# Altium project MPPT.PrjPcb
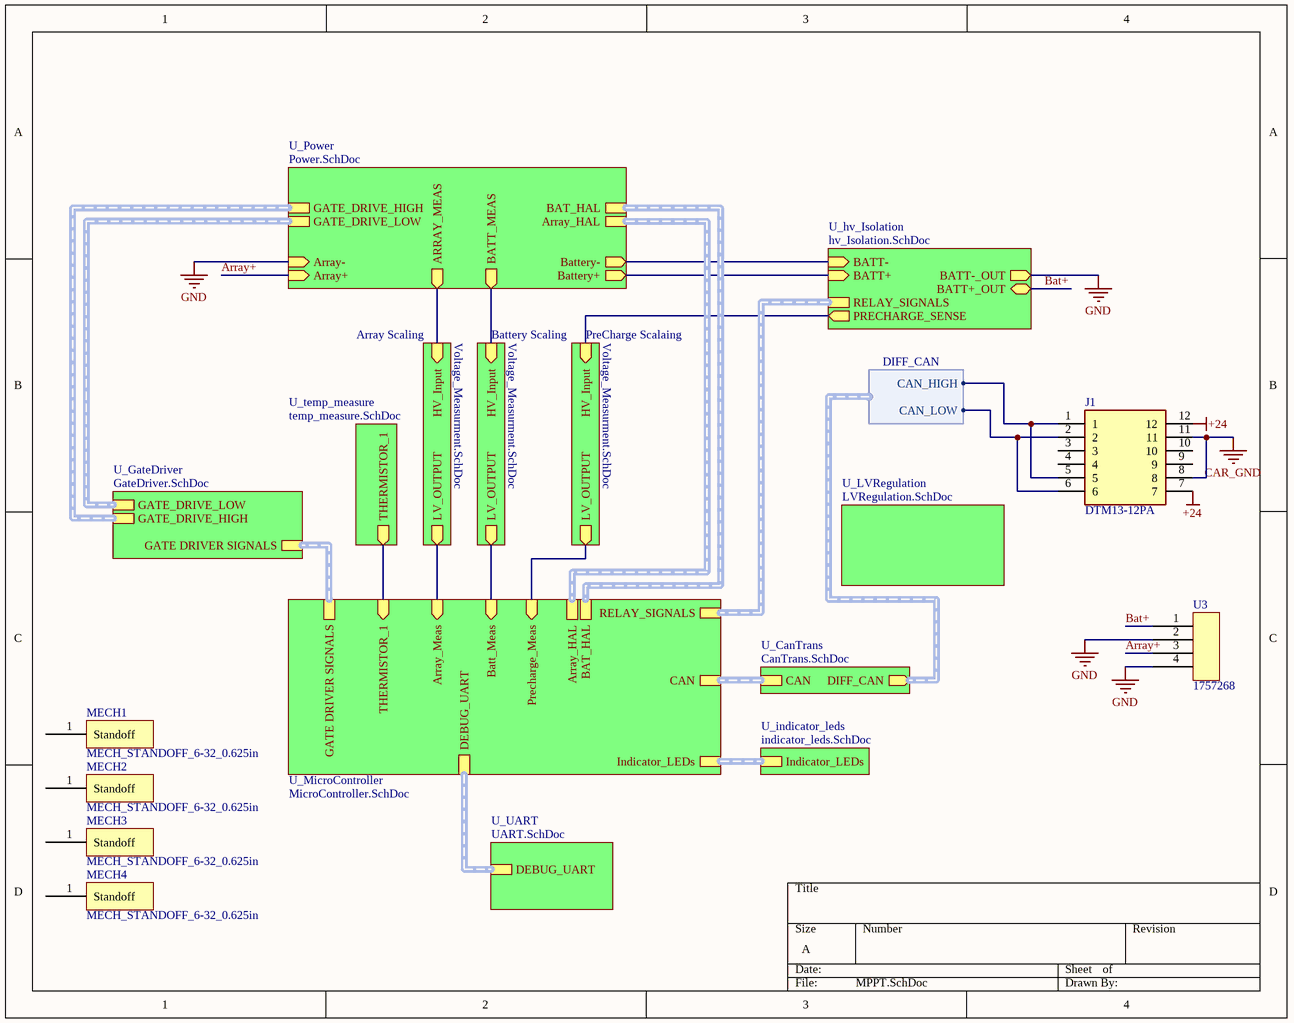
[diagram p0: MPPT.SchDoc]
12 sheets, 127 parts. Net scope: hierarchical (ports join the sheet entries above them; power ports are global).
Board file: MPPT.PcbDoc
Sheets:
  MPPT.SchDoc
    U_GateDriver = GateDriver.SchDoc
    U_Power = Power.SchDoc
    U_MicroController = MicroController.SchDoc
      U_JTAG = JTAG.SchDoc
    U_CanTrans = CanTrans.SchDoc
    Array Scaling = Voltage_Measurment.SchDoc
    Battery Scaling = Voltage_Measurment.SchDoc
    U_LVRegulation = LVRegulation.SchDoc
    U_hv_Isolation = hv_Isolation.SchDoc
    U_indicator_leds = indicator_leds.SchDoc
    U_temp_measure = temp_measure.SchDoc
    PreCharge Scalaing = Voltage_Measurment.SchDoc
    U_UART = UART.SchDoc

## Sheet MPPT.SchDoc
size A; SheetNumber: 1; SheetTotal: 12

### Parts
J1  DTM13-12PA  [TE_DTM13-12PA]
MECH1  MECH_STANDOFF_6-32_0.625in  [STANDOFF_6-32_0.625in]
MECH2  MECH_STANDOFF_6-32_0.625in  [STANDOFF_6-32_0.625in]
MECH3  MECH_STANDOFF_6-32_0.625in  [STANDOFF_6-32_0.625in]
MECH4  MECH_STANDOFF_6-32_0.625in  [STANDOFF_6-32_0.625in]
U3  1757268  [1757268-Footprint-1]

### Sub-sheets
Array Scaling = Voltage_Measurment.SchDoc: LV_OUTPUT (out), HV_Input (in)
Battery Scaling = Voltage_Measurment.SchDoc: LV_OUTPUT (out), HV_Input (in)
PreCharge Scalaing = Voltage_Measurment.SchDoc: LV_OUTPUT (out), HV_Input (in)
U_CanTrans = CanTrans.SchDoc: CAN (harness CAN), DIFF_CAN (out, harness DIFF_CAN)
U_GateDriver = GateDriver.SchDoc: GATE DRIVER SIGNALS (harness Gate Driver), GATE_DRIVE_HIGH (harness GATE_DRIVE), GATE_DRIVE_LOW (harness GATE_DRIVE)
U_hv_Isolation = hv_Isolation.SchDoc: BATT+_OUT (bidir), BATT-_OUT (out), BATT+ (in), BATT- (in), RELAY_SIGNALS, PRECHARGE_SENSE (out)
U_indicator_leds = indicator_leds.SchDoc: Indicator_LEDs (harness Indicator LEDs)
U_LVRegulation = LVRegulation.SchDoc: no entries
U_MicroController = MicroController.SchDoc: CAN (harness CAN), Batt_Meas (in), Array_Meas (in), GATE DRIVER SIGNALS (harness Gate Driver), RELAY_SIGNALS (harness RELAY SIGNALS), Indicator_LEDs, THERMISTOR_1 (in), BAT_HAL, Array_HAL, Precharge_Meas (in), DEBUG_UART (harness DEBUG_UART)
U_Power = Power.SchDoc: Array- (in), Array+ (in), Battery+ (out), Battery- (out), GATE_DRIVE_HIGH, GATE_DRIVE_LOW, BATT_MEAS (out), ARRAY_MEAS (out), BAT_HAL (harness HAL_OUTPUT), Array_HAL (harness HAL_OUTPUT)
U_temp_measure = temp_measure.SchDoc: THERMISTOR_1 (out)
U_UART = UART.SchDoc: DEBUG_UART

### Harnesses
DIFF_CAN: CAN_HIGH, CAN_LOW

### Nets
+24: J1.7 J1.12
CAR_GND: J1.8 J1.11
GND: U3.2 U3.4 ; sheet U_Power/Array-, sheet U_Power/Battery-, sheet U_hv_Isolation/BATT-_OUT, sheet U_hv_Isolation/BATT-
Array+: U3.3 ; sheet U_Power/Array+
Array_Measure: sheet U_Power/ARRAY_MEAS, sheet Array Scaling/HV_Input
Bat+: U3.1 ; sheet U_hv_Isolation/BATT+_OUT
boost_output: sheet U_Power/BATT_MEAS, sheet Battery Scaling/HV_Input
CAN_N: J1.2 J1.6 ; sheet U_CanTrans/DIFF_CAN.CAN_LOW
CAN_P: J1.1 J1.5 ; sheet U_CanTrans/DIFF_CAN.CAN_HIGH
NetC27A_2: sheet U_MicroController/Array_Meas, sheet Array Scaling/LV_OUTPUT
NetC27B_2: sheet U_MicroController/Batt_Meas, sheet Battery Scaling/LV_OUTPUT
NetC27C_2: sheet U_MicroController/Precharge_Meas, sheet PreCharge Scalaing/LV_OUTPUT
NetF1_2: sheet U_Power/Battery+, sheet U_hv_Isolation/BATT+
NetJ3_2: sheet U_MicroController/THERMISTOR_1, sheet U_temp_measure/THERMISTOR_1
NetK1_4: sheet U_hv_Isolation/PRECHARGE_SENSE, sheet PreCharge Scalaing/HV_Input

Not connected (* = marked no-connect by the designer): J1 3 4 9 10; MECH1 1(Standoff); MECH2 1(Standoff); MECH3 1(Standoff); MECH4 1(Standoff)

### Buses and harness runs
harness sheet U_CanTrans/CAN = sheet U_MicroController/CAN
harness sheet U_GateDriver/GATE DRIVER SIGNALS = sheet U_MicroController/GATE DRIVER SIGNALS
harness sheet U_GateDriver/GATE_DRIVE_HIGH = sheet U_Power/GATE_DRIVE_HIGH
harness sheet U_GateDriver/GATE_DRIVE_LOW = sheet U_Power/GATE_DRIVE_LOW
harness sheet U_hv_Isolation/RELAY_SIGNALS = sheet U_MicroController/RELAY_SIGNALS
harness sheet U_indicator_leds/Indicator_LEDs = sheet U_MicroController/Indicator_LEDs
harness sheet U_MicroController/Array_HAL = sheet U_Power/Array_HAL
harness sheet U_MicroController/BAT_HAL = sheet U_Power/BAT_HAL
harness sheet U_MicroController/DEBUG_UART = sheet U_UART/DEBUG_UART

### Library data of the parts
J1 = CMP-183-000000-3: 12 way DTM13 A key Receptacle with PCB mount and 90 degree molded pins. Sealable, with centerline pitch .165 inch/4 millimeters. Gray.; Gender: Male; Voltage Rating: 250V; Connector Type: COMBINATION LINE CONNECTOR; Max Current Rating: 11A; Mounting Technology: TH; Case/Package: 12-DIP; Pins: 12; RoHS Compliant: Yes
MECH1-MECH4 = CMP-044-000005-2: Hex Standoff Threaded #6-32 Aluminum 0.625" (15.88mm) 5/8"; Design Item ID: MECH_STANDOFF_6-32_0.625in; Source: mech.SchLib
U3 = CMP-002-00132-2: Strip Terminal Block, 12A, 1 Row(s), 1 Deck(s); Plug: 1110583; Gender: Male; Connector Type: Header; Voltage Rating: 250V; Max Current Rating: 12A; Mounting Technology: TH; Case/Package: SIP-4; Pins: 4; RoHS Compliant: Yes

## Sheet GateDriver.SchDoc
size A; SheetNumber: 2; SheetTotal: 12
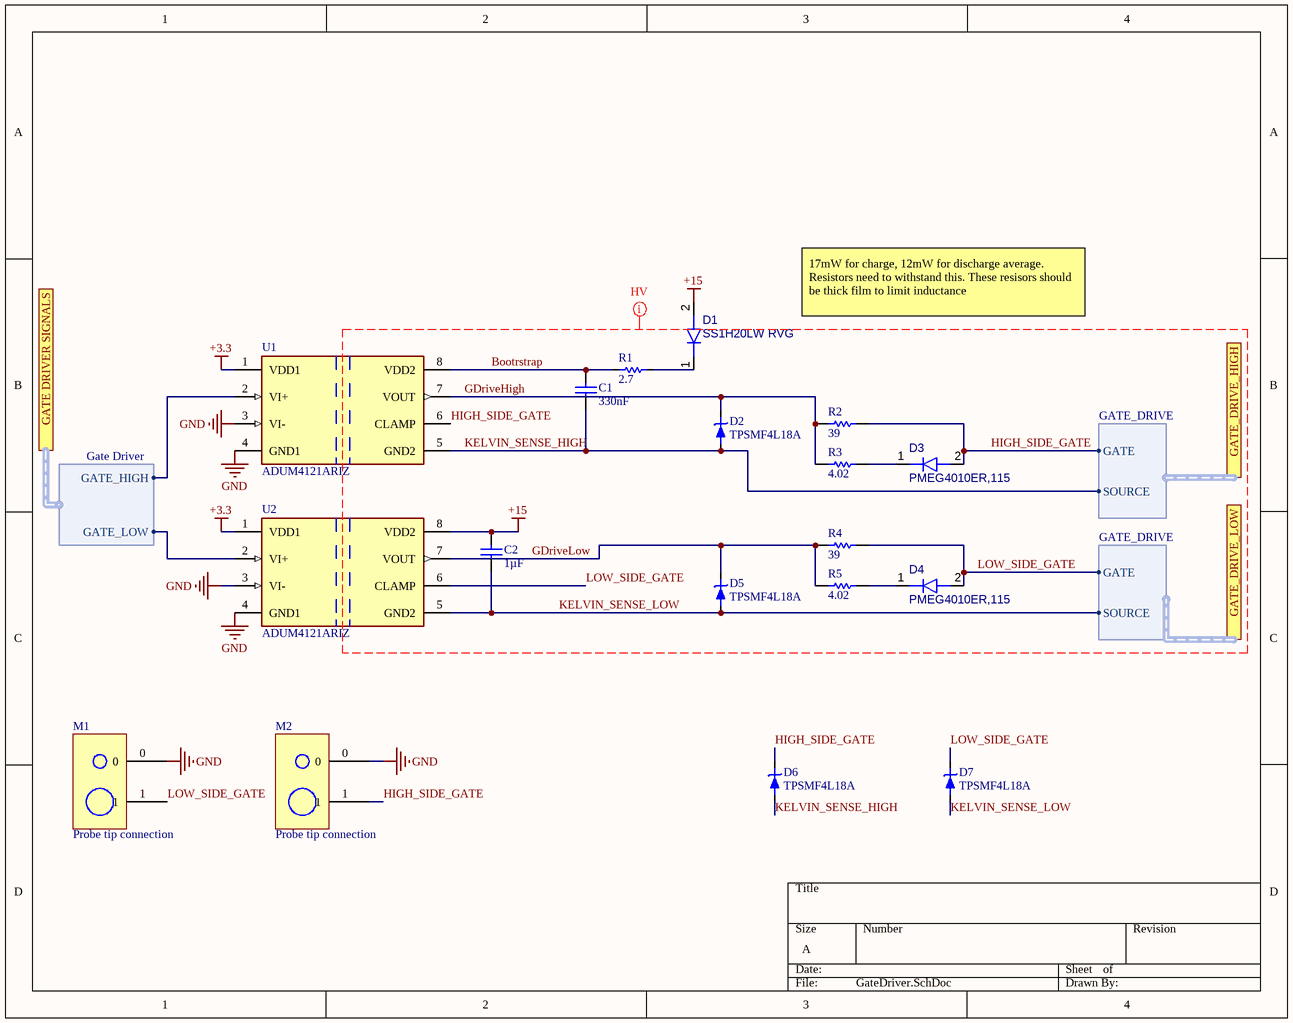
[diagram p1: GateDriver.SchDoc]

### Parts
C1  value 330nF  [1206_CAPACITOR]  (hidden comment: C1206X334K5RACAUTO)
C2  value 1µF  [0805_Capacitor]  (hidden comment: CAP 0805 1uF 50V)
D1  SS1H20LW RVG  [PMEG4010ER,115-Footprint-1]
D2  TPSMF4L18A  [TPSMF4L18A-Footprint-1]
D3  PMEG4010ER,115  [PMEG4010ER,115-Footprint-1]
D4  PMEG4010ER,115  [PMEG4010ER,115-Footprint-1]
D5  TPSMF4L18A  [TPSMF4L18A-Footprint-1]
D6  TPSMF4L18A  [TPSMF4L18A-Footprint-1]
D7  TPSMF4L18A  [TPSMF4L18A-Footprint-1]
M1  Probe tip connection  [Probe tip connection-Footprint-1]
M2  Probe tip connection  [Probe tip connection-Footprint-1]
R1  value 2.7  [1210_Resistor]  (hidden comment: R_CRCW12102R70JNEA)
R2  value 39  [0805_Resistor]  (hidden comment: RMCF0805JT39R0)
R3  value 4.02  [0805_Resistor]  (hidden comment: CRCW08054R02FKEA)
R4  value 39  [0805_Resistor]  (hidden comment: RMCF0805JT39R0)
R5  value 4.02  [0805_Resistor]  (hidden comment: CRCW08054R02FKEA)
U1  ADUM4121ARIZ  [FP-RI-8-1-IPC_B]
U2  ADUM4121ARIZ  [FP-RI-8-1-IPC_B]

### Ports
GATE DRIVER SIGNALS (harness Gate Driver, see MPPT[1C], MicroController[3A]), GATE_DRIVE_HIGH (harness GATE_DRIVE, see MPPT[1C], Power[3C]), GATE_DRIVE_LOW (harness GATE_DRIVE, see MPPT[1B], Power[3C])

### Harnesses
Gate Driver: GATE_HIGH, GATE_LOW
GATE_DRIVE: SOURCE, GATE

### Nets
+3.3: U1.1(VDD1) U2.1(VDD1)
+15: C2.2 D1.2(A) U2.8(VDD2)
GND: M1.0 M2.0 U1.3(VI-) U1.4(GND1) U2.3(VI-) U2.4(GND1)
Bootrstrap: C1.2 R1.1 U1.8(VDD2)
GATE_HIGH: U1.2(VI+) ; port GATE DRIVER SIGNALS.GATE_HIGH
GATE_LOW: U2.2(VI+) ; port GATE DRIVER SIGNALS.GATE_LOW
GDriveHigh: D2.2(Cathode) R2.1 R3.1 U1.7(VOUT)
GDriveLow: D5.2(Cathode) R4.1 R5.1 U2.7(VOUT)
HIGH_SIDE_GATE: D3.2(A) D6.2(Cathode) M2.1 R2.2 U1.6(CLAMP) ; port GATE_DRIVE_HIGH.GATE
KELVIN_SENSE_HIGH: C1.1 D2.1(Anode) D6.1(Anode) U1.5(GND2) ; port GATE_DRIVE_HIGH.SOURCE
KELVIN_SENSE_LOW: C2.1 D5.1(Anode) D7.1(Anode) U2.5(GND2) ; port GATE_DRIVE_LOW.SOURCE
LOW_SIDE_GATE: D4.2(A) D7.2(Cathode) M1.1 R4.2 U2.6(CLAMP) ; port GATE_DRIVE_LOW.GATE
NetD1_1: D1.1(K) R1.2
NetD3_1: D3.1(K) R3.2
NetD4_1: D4.1(K) R5.2

### Layout directives
net class HV: +15, Bootrstrap, GDriveHigh, GDriveLow, HIGH_SIDE_GATE, KELVIN_SENSE_HIGH, KELVIN_SENSE_LOW, LOW_SIDE_GATE

### Notes on the sheet
- 17mW for charge, 12mW for discharge average. Resistors need to withstand this. These resisors should be thick film to limit inductance

### Library data of the parts
C1 = CMP-001-00124-1: Ceramic Capacitor, Multilayer, Ceramic, 50V, 10% +Tol, 10% -Tol, X7R, 15% TC, 0.33uF, Surface Mount, 1206; Pins: 2; Case/Package: 1206; Tolerance: 10%; Max Operating Temperature: 125°C; Capacitor Type: Ceramic; Mounting Technology: SMD; Voltage Rating: 50V; Min Operating Temperature: -55°C
C2 = CMP-001-00098-1: Tolerance: 10%; Capacitor Type: Ceramic; Voltage Rating: 50V; Case/Package: 0805; Mounting Technology: SMT
D1 = CMP-004-00055-1: Rectifier Diode Schottky 200V 1A 2-Pin SOD-123W T/R; Max Surge Current: 40A; Forward Voltage: 490mV; Forward Current: 1A; Max Operating Temperature: 150°C; Average Rectified Current: 1A; Packaging: Tape and Reel; RoHS Compliant: Yes; Pins: 2; Mounting Technology: Surface Mount; Max Reverse Voltage (DC): 200V
D2 D5-D7 = CMP-004-00053-2: TVS DIODE 18V 29.2V SOD123FL; Min Breakdown Voltage: 20V; Peak Pulse Power: 400W; Number of Unidirectional Channels: 1; Peak Pulse Current: 13.7A; Power Line Protection: No; Max Operating Temperature: 150°C; Packaging: Cut Tape; Min Operating Temperature: -55°C; RoHS Compliant: Yes; Reverse Standoff Voltage: 18V; Resistor Type: Zener; Mounting Technology: Surface Mount; Clamping Voltage: 29.2V
D3 D4 = CMP-004-00045-1: Rectifier Diode, Schottky, 1 Phase, 1 Element, 1A, 40V V(RRM), Silicon; Max Surge Current: 40A; Forward Voltage: 490mV; Forward Current: 1A; Peak Inverse Voltage: 40V; Max Operating Temperature: 150°C; Case/Package: SOD-123W; RoHS Compliant: Yes; Pins: 2; Mounting Technology: SMD
M1 M2 = CMP-00028-00009-3: Connection for oscilscope ground tip
R1 = CMP-058-000074-3: RES SMD 2.7 OHM 5% 1/2W 1210; Power: 500mW; Voltage Rating: 200V; Min Operating Temperature: -55°C; Case/Package: 1210; Pins: 2; Max Operating Temperature: 155°C; Tolerance: 5%; Mounting Technology: SMD
R2 R4 = Resistor     0012-1: Fixed Resistor, Metal Glaze/thick Film, 0.125W, 39ohm, 150V, 5% +/-Tol, 200ppm/Cel, Surface Mount, 0805; Power: 125mW; Mounting Technology: SMD; Min Operating Temperature: -55°C; RoHS Compliant: Yes; Tolerance: 5%; Max Operating Temperature: 155°C; Case/Package: 0805
R3 R5 = Resistor     0013-1: Fixed Resistor, Metal Glaze/thick Film, 0.125W, 4.02ohm, 150V, 1% +/-Tol, 100ppm/Cel, Surface Mount, 0805; Power: 125mW; Tolerance: 1%; Mounting Technology: SMD; Min Operating Temperature: -55°C; Case/Package: 0805; RoHS Compliant: Yes; Max Operating Temperature: 155°C
U1 U2 = CMP-00024-00007-1: 2A gat driver; Pins: 8; RoHS Compliant: Yes; Max Operating Temperature: 125°C; Min Operating Temperature: -40°C

## Sheet Power.SchDoc
size B; SheetNumber: 3; SheetTotal: 12
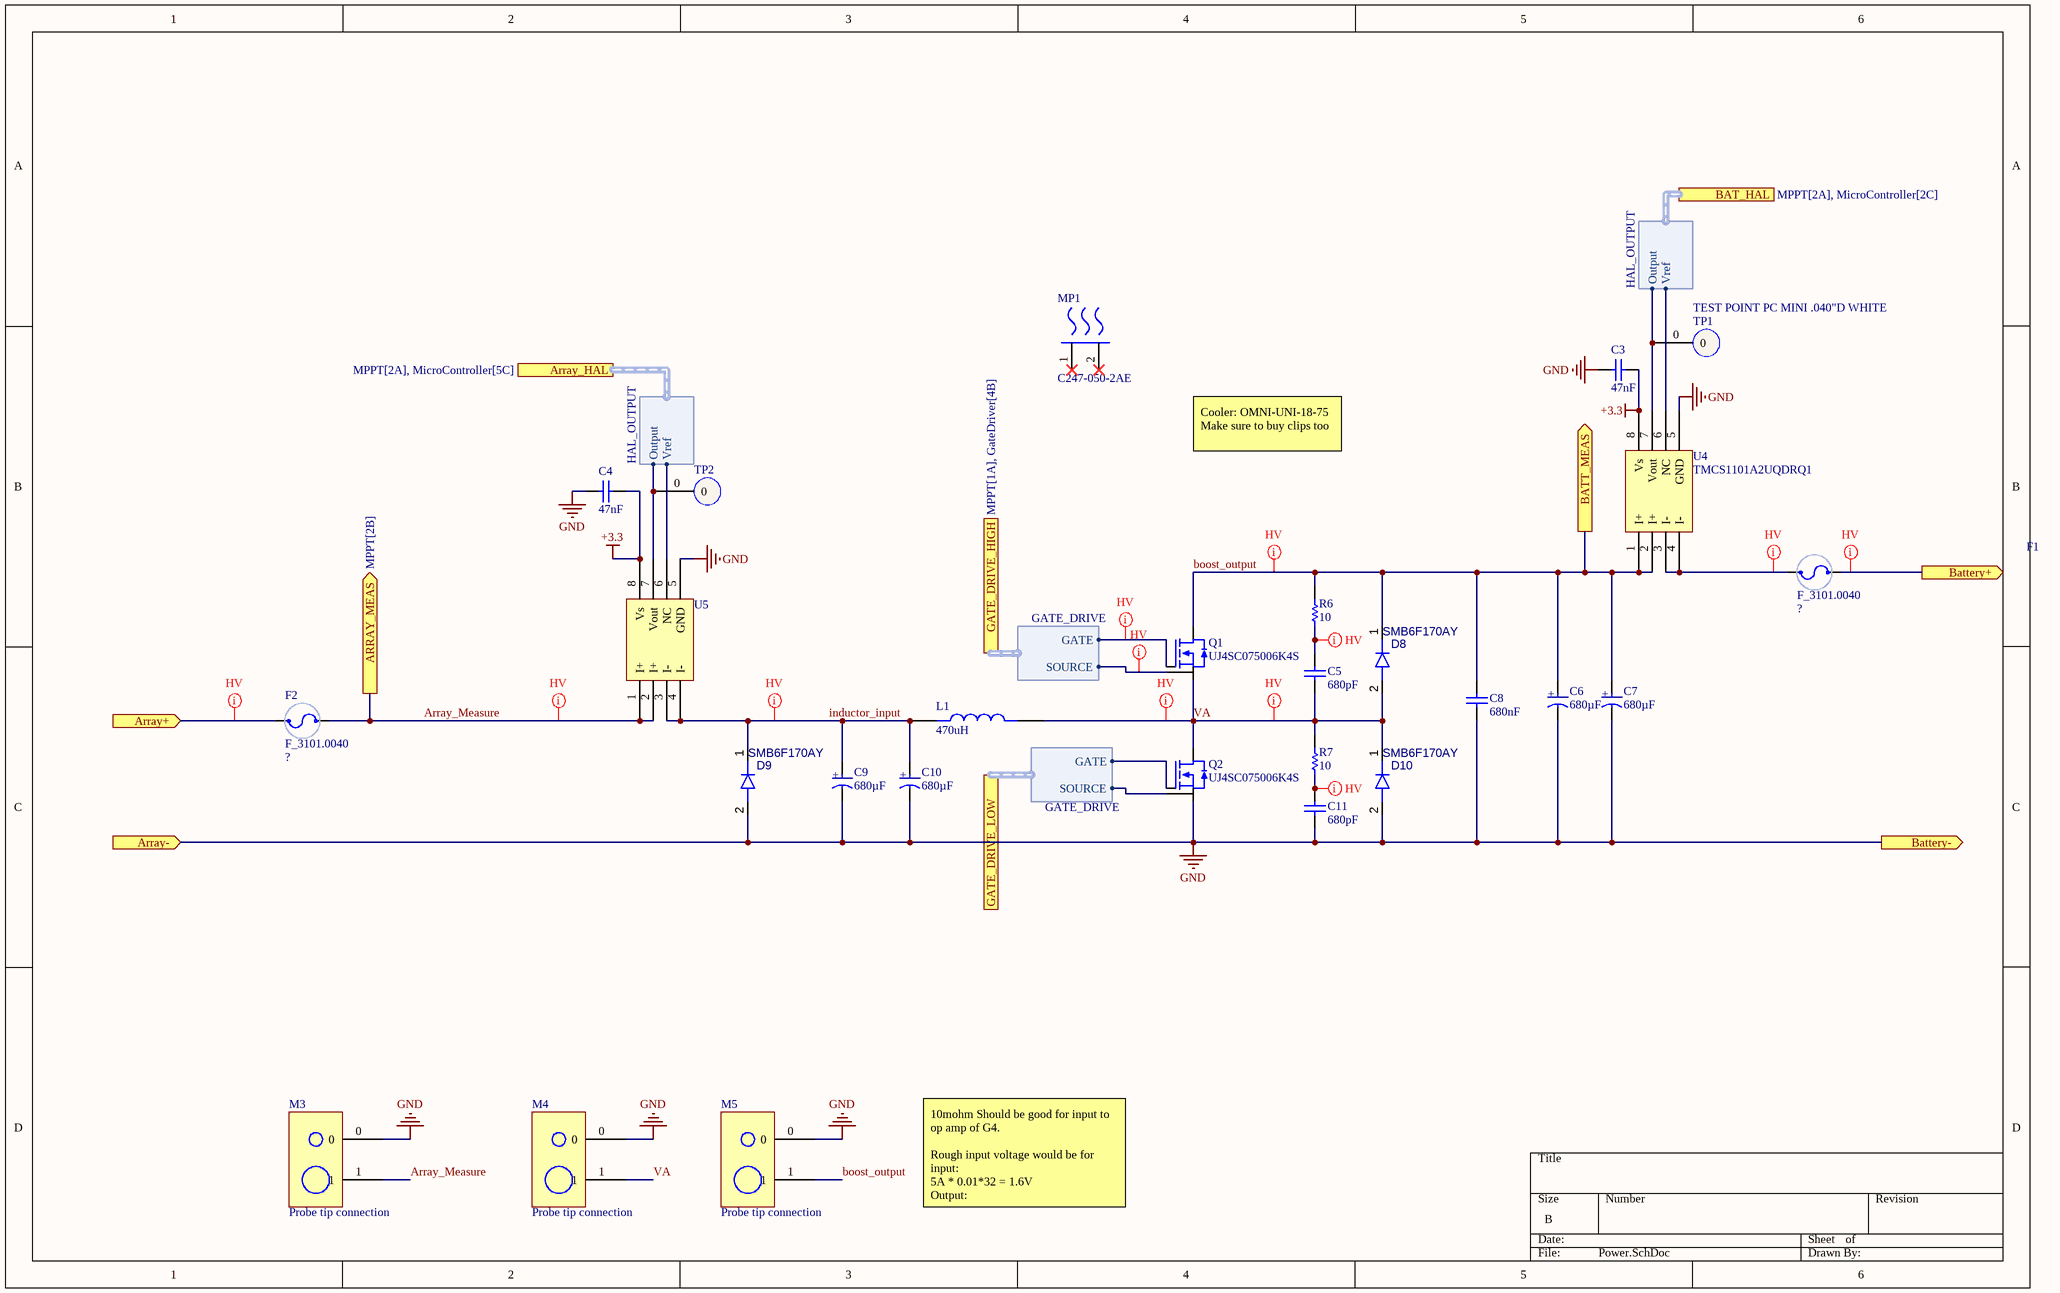
[diagram p2: Power.SchDoc]

### Parts
C3  value 47nF  [0603_CAPACITOR]  (hidden comment: C0603C473K4RECAUTO)
C4  value 47nF  [0603_CAPACITOR]  (hidden comment: C0603C473K4RECAUTO)
C5  value 680pF  [0805_Capacitor]  (hidden comment: C0805C681K2RAC7800)
C6  value 680µF  [381LR681M200J032-Footprint-1]  (hidden comment: 381LR681M200K022)
C7  value 680µF  [381LR681M200J032-Footprint-1]  (hidden comment: 381LR681M200K022)
C8  value 680nF  [684MMR400K-Footprint-1]  (hidden comment: 684MMR400K)
C9  value 680µF  [381LR681M200J032-Footprint-1]  (hidden comment: 381LR681M200K022)
C10  value 680µF  [381LR681M200J032-Footprint-1]  (hidden comment: 381LR681M200K022)
C11  value 680pF  [0805_Capacitor]  (hidden comment: C0805C681K2RAC7800)
D8  SMB6F170AY  [SMB6F170AY-Footprint-1]
D9  SMB6F170AY  [SMB6F170AY-Footprint-1]
D10  SMB6F170AY  [SMB6F170AY-Footprint-1]
F1  F_3101.0040  [F_FPG4]
F2  F_3101.0040  [F_FPG4]
L1  value 470uH  [ATCA-08-471M-H-Footprint-1]  (hidden comment: ATCA-08-471M-H)
M3  Probe tip connection  [Probe tip connection-Footprint-1]
M4  Probe tip connection  [Probe tip connection-Footprint-1]
M5  Probe tip connection  [Probe tip connection-Footprint-1]
MP1  C247-050-2AE  [FP-C247-050-2AE-MFG]
Q1  UJ4SC075006K4S  [T_TO_247_4L_UNITEDSIC - Vertical]
Q2  UJ4SC075006K4S  [T_TO_247_4L_UNITEDSIC - Vertical]
R6  value 10  [1210_Resistor]  (hidden comment: Resistor 1210 10 ohm 1%)
R7  value 10  [1210_Resistor]  (hidden comment: Resistor 1210 10 ohm 1%)
TP1  TEST POINT PC MINI .040"D WHITE  [TEST POINT 0.040" WHITE]
TP2  TEST POINT PC MINI .040"D WHITE  [TEST POINT 0.040" WHITE]  (value not drawn)
U4  TMCS1101A2UQDRQ1  [SOIC127P610X173-8N]
U5  TMCS1101A2UQDRQ1  [SOIC127P610X173-8N]  (value not drawn)

### Ports
Array+ (in, see MPPT[1B]), Array- (in, see MPPT[1B]), Array_HAL (harness HAL_OUTPUT, see MPPT[2A], MicroController[5C]), ARRAY_MEAS (out, see MPPT[2B]), BAT_HAL (harness HAL_OUTPUT, see MPPT[2A], MicroController[2C]), BATT_MEAS (out, see MPPT[2B]), Battery+ (out, see MPPT[2B]), Battery- (out, see MPPT[2B]), GATE_DRIVE_HIGH (harness GATE_DRIVE, see MPPT[1A], GateDriver[4B]), GATE_DRIVE_LOW (harness GATE_DRIVE, see MPPT[1A], GateDriver[4C])

### Harnesses
GATE_DRIVE: GATE, SOURCE
HAL_OUTPUT: Vref, Output

### Nets
+3.3: C3.2 C4.2 U4.8(Vs) U5.8(Vs)
GND: C3.1 C4.1 C6.1 C7.1 C8.1 C9.1 C10.1 C11.1 D9.2(A) D10.2(A) M3.0 M4.0 M5.0 Q2.2(S) U4.5(GND) U5.5(GND) ; port Array-, port Battery-
Array+: F2.1 ; port Array+
Array_HAL_REF: U5.6(NC) ; port Array_HAL.Vref
Array_Measure: F2.2 M3.1 U5.1(I+) U5.2(I+) ; port ARRAY_MEAS
BAT_HAL_REF: U4.6(NC) ; port BAT_HAL.Vref
boost_output: C6.2 C7.2 C8.2 D8.1(K) M5.1 Q1.1(D) R6.2 U4.1(I+) U4.2(I+) ; port BATT_MEAS
HIGH_SIDE_GATE: Q1.4(G) ; port GATE_DRIVE_HIGH.GATE
inductor_input: C9.2 C10.2 D9.1(K) L1.1 U5.3(I-) U5.4(I-)
KELVIN_SENSE_HIGH: Q1.3(K) ; port GATE_DRIVE_HIGH.SOURCE
KELVIN_SENSE_LOW: Q2.3(K) ; port GATE_DRIVE_LOW.SOURCE
LOW_SIDE_GATE: Q2.4(G) ; port GATE_DRIVE_LOW.GATE
VA: C5.1 D8.2(A) D10.1(K) L1.2 M4.1 Q1.2(S) Q2.1(D) R7.2
NetC5_2: C5.2 R6.1
NetC11_2: C11.2 R7.1
NetF1_1: F1.1 U4.3(I-) U4.4(I-)
NetF1_2: F1.2 ; port Battery+
NetTP1_0: TP1.0 U4.7(Vout) ; port BAT_HAL.Output
NetTP2_0: TP2.0 U5.7(Vout) ; port Array_HAL.Output

Not connected (* = marked no-connect by the designer): MP1 1(MNT_1)* 2(MNT_2)*

### Layout directives
net class HV: Array+, Array_Measure, boost_output, HIGH_SIDE_GATE, inductor_input, KELVIN_SENSE_HIGH, NetC5_2, NetC11_2, NetF1_1, NetF1_2, VA

### Notes on the sheet
- Cooler: OMNI-UNI-18-75
  Make sure to buy clips too
- 10mohm Should be good for input to op amp of G4.
  Rough input voltage would be for input:
  5A * 0.01*32 = 1.6V
  Output:
  2A * 0.01*64 = 1.28
- (in symbol CMP-001-00126-3) +

### Library data of the parts
C3 C4 = CMP-001-00133-1: Ceramic Capacitor, Multilayer, Ceramic, 16V, 10% +Tol, 10% -Tol, X7R, 15% TC, 0.047uF, Surface Mount, 0603; Mounting Technology: SMD; Tolerance: 10%; Capacitor Type: Ceramic; Case/Package: 0603; Voltage Rating: 16V
C5 C11 = CMP-001-00128-1: Ceramic Capacitor, Multilayer, Ceramic, 200V, 10% +Tol, 10% -Tol, X7R, -/+15ppm/Cel TC, 0.00068uF, 0805; Case/Package: 0805; Pins: 2; Min Operating Temperature: -55°C; Capacitor Type: Ceramic; Max Operating Temperature: 125°C; Mounting Technology: SMD; Tolerance: 10%; Voltage Rating: 200V
C6 C7 C9 C10 = CMP-001-00126-3: Aluminum Electrolytic Capacitor, Polarized, Aluminum (wet), 200V, 20% +Tol, 20% -Tol, 680uF, Through Hole Mount; Ripple Current (AC): 3.45A; Capacitor Type: Aluminium; Ripple Current: 2.42A; Case/Package: Can; Mounting Technology: TH; Voltage Rating: 200V; Tolerance: 20%; Pins: 2; Min Operating Temperature: -40°C; Max Operating Temperature: 105°C
C8 = CMP-001-00127-2: Film Capacitor, Polyester, 400V, 10% +Tol, 10% -Tol, 0.68uF, Through Hole Mount; Voltage Rating: 200V; Tolerance: 10%; Max Operating Temperature: 85°C; Mounting Technology: TH; Case/Package: Bulk; Min Operating Temperature: -55°C; Pins: 2; Capacitor Type: FILM
D8-D10 = CMP-004-00044-1: TVS Diodes / ESD Suppressors Automotive 600 W, 170 V TVS in SMB Flat; Peak Inverse Voltage: 170V; Max Surge Current: 2.2A; Pins: 2; Min Operating Temperature: -55°C; Mounting Technology: SMD; Max Operating Temperature: 175°C; Case/Package: SMBflat; RoHS Compliant: Yes
F1 F2 = CMP-047-000004-2: Fuse Holder 16A 500V 1 Circuit Cartridge PCB; Manufacturer: Schurter; Voltage Rating (AC): 400V; Power Dissipation: 2.5W; Body Material: Thermoplastic; Voltage Rating (DC): 250V; Approvals: UL,CSA,VDE,IEC,SEMKO; Value: ?; Max Current: 16A; Manufacturer Part Number: 3101.0040; Min Operating Temperature: -40°C; Source: misc.SchLib; Design Item ID: F_3101.0040; Max Operating Temperature: 85°C
L1 = CMP-006-00025-8: Coustom wound inductor using 79617A7 core; Tolerance: 20%; Max Current Rating: 11A; Min Operating Temperature: 105°C; Max Operating Temperature: -40°C; Pins: 2; Mounting Technology: TH; RoHS Compliant: Yes; Case/Package: torodial; Current Rating: 11A
M3-M5 = CMP-00028-00009-3: Connection for oscilscope ground tip
MP1 = CMP-00028-00008-1: Heat Sink 2 TO-247 components; RoHS Compliant: Yes; Mounting Technology: TH; Pins: 2
Q1 Q2 = CMP-013-00040-6: 750V/6MOHM, Sic, Stacked Cascode; Manufacturer Part Number: UF3SC065007K4S; Nominal Vgs: 15V; Vgs (Max): 20V; Heatsink PN: C247-025-1AE; Vgs(th) (Max) @ Id: 15; RoHS Compliant: Yes; Transistor Type: SIC; Max Operating Temperature: 125°C; Min Operating Temperature: -40°C; Case/Package: TO247 4L; Mounting Technology: TH; Pins: 4
R6 R7 = CMP-00035-2: Res Thick Film 1210 10 Ohm 1% 1/3W ±100ppm/°C Molded SMD SMD Plastic T/R; Voltage Rating: 200V; Power: 0.5W; Footprint: 1210; Tolerance: 1%
TP1 TP2 = CMP-113-000002-1: Design Item ID: TEST POINT PC MINI .040"D WHITE; Source: Common.SchLib
U4 U5 = CMP-010-00029-1: Automotive, precision isolated current sensor with internal reference 8-SOIC -40 to 125; Max Supply Voltage: 5.5V; Min Supply Voltage: 3; Sensor Type: Hall; Nominal Supply Current: 26mA; Nominal Supply Voltage: 3.3V; Max Operating Temperature: 125°C; Min Operating Temperature: -40°C; Pins: 8; Case/Package: 8-SOIC; Mounting Technology: SMD; RoHS Compliant: Yes

## Sheet MicroController.SchDoc
size B; SheetNumber: 4; SheetTotal: 12
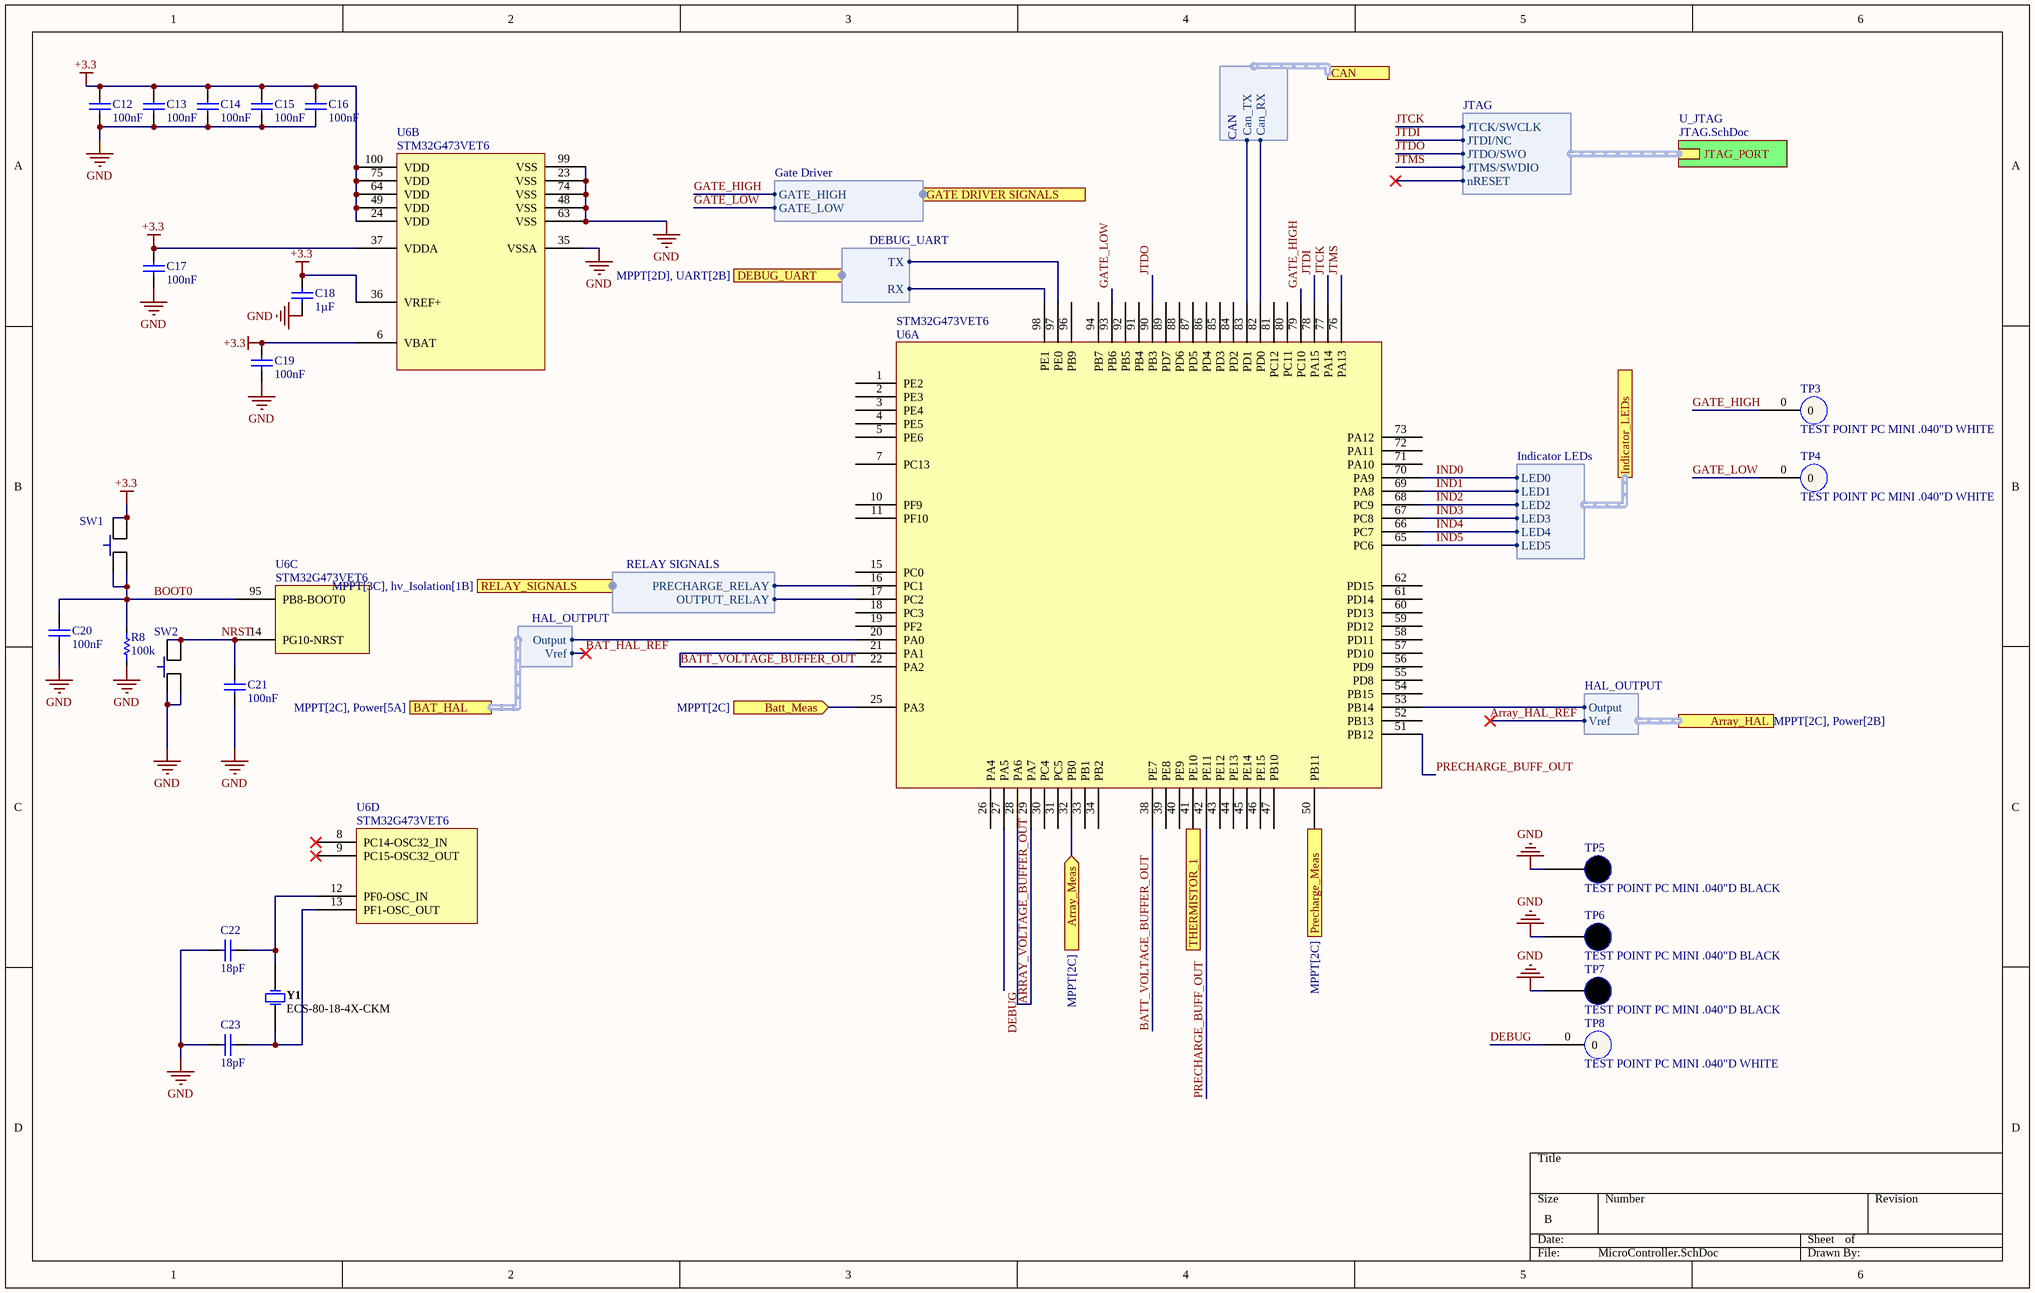
[diagram p3: MicroController.SchDoc]

### Parts
C12  value 100nF  [CAPC1608X90X40ML10T20]  (hidden comment: Capacitor 0.1uF +/-10% 50 V 0603)
C13  value 100nF  [CAPC1608X90X40ML10T20]  (hidden comment: Capacitor 0.1uF +/-10% 50 V 0603)
C14  value 100nF  [CAPC1608X90X40ML10T20]  (hidden comment: Capacitor 0.1uF +/-10% 50 V 0603)
C15  value 100nF  [CAPC1608X90X40ML10T20]  (hidden comment: Capacitor 0.1uF +/-10% 50 V 0603)
C16  value 100nF  [CAPC1608X90X40ML10T20]  (hidden comment: Capacitor 0.1uF +/-10% 50 V 0603)
C17  value 100nF  [CAPC1608X90X40ML10T20]  (hidden comment: Capacitor 0.1uF +/-10% 50 V 0603)
C18  value 1µF  [0805_Capacitor]  (hidden comment: CAP 0805 1uF 50V)
C19  value 100nF  [CAPC1608X90X40ML10T20]  (hidden comment: Capacitor 0.1uF +/-10% 50 V 0603)
C20  value 100nF  [CAPC1608X90X40ML10T20]  (hidden comment: Capacitor 0.1uF +/-10% 50 V 0603)
C21  value 100nF  [CAPC1608X90X40ML10T20]  (hidden comment: Capacitor 0.1uF +/-10% 50 V 0603)
C22  value 18pF  [0603_CAPACITOR]  (hidden comment: Capacitor 18pF 0603 50V 10%)
C23  value 18pF  [0603_CAPACITOR]  (hidden comment: Capacitor 18pF 0603 50V 10%)
R8  value 100k  [0603_RESISTOR]  (hidden comment: Res 0603 100K ohm 1%)
SW1  SW_TACT_SWITCH_6x6  [TACT_SWITCH_6x6_J-LEAD]  (value not drawn)
SW2  SW_TACT_SWITCH_6x6  [TACT_SWITCH_6x6_J-LEAD]  (value not drawn)
TP3  TEST POINT PC MINI .040"D WHITE  [TEST POINT 0.040" WHITE]
TP4  TEST POINT PC MINI .040"D WHITE  [TEST POINT 0.040" WHITE]
TP5  TEST POINT PC MINI .040"D BLACK  [TEST POINT 0.040" BLACK]
TP6  TEST POINT PC MINI .040"D BLACK  [TEST POINT 0.040" BLACK]
TP7  TEST POINT PC MINI .040"D BLACK  [TEST POINT 0.040" BLACK]
TP8  TEST POINT PC MINI .040"D WHITE  [TEST POINT 0.040" WHITE]
U6  STM32G473VET6  [TSQFP50P1600X1600X160-100N]  (parts A,B,C,D of 4)
Y1  ECS-80-18-4X-CKM  [ECS-80-18-4X-CKM-Footprint-1]

### Sub-sheets
U_JTAG = JTAG.SchDoc: JTAG_PORT (harness JTAG)

### Ports
Array_HAL (harness HAL_OUTPUT, see MPPT[2C], Power[2B]), Array_Meas (in, see MPPT[2C]), BAT_HAL (harness HAL_OUTPUT, see MPPT[2C], Power[5A]), Batt_Meas (in, see MPPT[2C]), CAN (harness CAN, see MPPT[3C], CanTrans[1B]), DEBUG_UART (harness DEBUG_UART, see MPPT[2D], UART[2B]), GATE DRIVER SIGNALS (harness Gate Driver, see MPPT[2C], GateDriver[1B]), Indicator_LEDs (harness Indicator LEDs, see MPPT[3C], indicator_leds[1B]), Precharge_Meas (in, see MPPT[2C]), RELAY_SIGNALS (harness RELAY SIGNALS, see MPPT[3C], hv_Isolation[1B]), THERMISTOR_1 (in, see MPPT[2C], temp_measure[1A])

### Harnesses
CAN: Can_RX, Can_TX
JTAG: JTCK/SWCLK, JTDI/NC, JTDO/SWO, JTMS/SWDIO, nRESET
Gate Driver: GATE_HIGH, GATE_LOW
RELAY SIGNALS: PRECHARGE_RELAY, OUTPUT_RELAY
Indicator LEDs: LED0, LED1, LED2, LED3, LED4, LED5
HAL_OUTPUT: Output, Vref
DEBUG_UART: TX, RX

### Nets
+3.3: C12.2 C13.2 C14.2 C15.2 C16.2 C17.2 C18.1 C19.2 SW1.2 SW1.3 U6.6(VBAT) U6.24(VDD) U6.36(VREF+) U6.37(VDDA) U6.49(VDD) U6.64(VDD) U6.75(VDD) U6.100(VDD)
GND: C12.1 C13.1 C14.1 C15.1 C16.1 C17.1 C18.2 C19.1 C20.1 C21.1 C22.1 C23.1 R8.1 SW2.1 SW2.4 TP5.0 TP6.0 TP7.0 U6.23(VSS) U6.35(VSSA) U6.48(VSS) U6.63(VSS) U6.74(VSS) U6.99(VSS)
ARRAY_VOLTAGE_BUFFER_OUT: U6.28(PA6) U6.29(PA7)
BATT_VOLTAGE_BUFFER_OUT: U6.21(PA1) U6.22(PA2) U6.38(PE7)
BOOT0: C20.2 R8.2 SW1.1 SW1.4 U6.95(PB8-BOOT0)
CAN_RX: U6.82(PD0) ; port CAN.Can_RX
CAN_TX: U6.83(PD1) ; port CAN.Can_TX
DEBUG: TP8.0 U6.27(PA5)
GATE_HIGH: TP3.0 U6.79(PC10) ; port GATE DRIVER SIGNALS.GATE_HIGH
GATE_LOW: TP4.0 U6.93(PB6) ; port GATE DRIVER SIGNALS.GATE_LOW
IND0: U6.70(PA9) ; port Indicator_LEDs.LED0
IND1: U6.69(PA8) ; port Indicator_LEDs.LED1
IND2: U6.68(PC9) ; port Indicator_LEDs.LED2
IND3: U6.67(PC8) ; port Indicator_LEDs.LED3
IND4: U6.66(PC7) ; port Indicator_LEDs.LED4
IND5: U6.65(PC6) ; port Indicator_LEDs.LED5
JTCK: U6.77(PA14) ; sheet U_JTAG/JTAG_PORT.JTCK/SWCLK
JTDI: U6.78(PA15) ; sheet U_JTAG/JTAG_PORT.JTDI/NC
JTDO: U6.90(PB3) ; sheet U_JTAG/JTAG_PORT.JTDO/SWO
JTMS: U6.76(PA13) ; sheet U_JTAG/JTAG_PORT.JTMS/SWDIO
NRST: C21.2 SW2.2 SW2.3 U6.14(PG10-NRST)
PRECHARGE_BUFF_OUT: U6.42(PE11) U6.51(PB12)
NetC22_2: C22.2 U6.12(PF0-OSC_IN) Y1.2
NetC23_2: C23.2 U6.13(PF1-OSC_OUT) Y1.1
NetC27A_2: U6.32(PB0) ; port Array_Meas
NetC27B_2: U6.25(PA3) ; port Batt_Meas
NetC27C_2: U6.50(PB11) ; port Precharge_Meas
NetJ3_2: U6.41(PE10) ; port THERMISTOR_1
NetJ4_1: U6.97(PE0) ; port DEBUG_UART.TX
NetJ4_2: U6.98(PE1) ; port DEBUG_UART.RX
NetR14_1: U6.16(PC1) ; port RELAY_SIGNALS.PRECHARGE_RELAY
NetR16_1: U6.17(PC2) ; port RELAY_SIGNALS.OUTPUT_RELAY
NetTP1_0: U6.20(PA0) ; port BAT_HAL.Output
NetTP2_0: U6.53(PB14) ; port Array_HAL.Output

Not connected (* = marked no-connect by the designer): U6 1(PE2) 2(PE3) 3(PE4) 4(PE5) 5(PE6) 7(PC13) 8(PC14-OSC32_IN)* 9(PC15-OSC32_OUT)* 10(PF9) 11(PF10) 15(PC0) 18(PC3) 19(PF2) 26(PA4) 30(PC4) 31(PC5) 33(PB1) 34(PB2) 39(PE8) 40(PE9) 43(PE12) 44(PE13) 45(PE14) 46(PE15) 47(PB10) 52(PB13) 54(PB15) 55(PD8) 56(PD9) 57(PD10) 58(PD11) 59(PD12) 60(PD13) 61(PD14) 62(PD15) 71(PA10) 72(PA11) 73(PA12) 80(PC11) 81(PC12) 84(PD2) 85(PD3) 86(PD4) 87(PD5) 88(PD6) 89(PD7) 91(PB4) 92(PB5) 94(PB7) 96(PB9)

### Library data of the parts
C12-C17 C19-C21 = CMP-001-00017-10: Chip Capacitor, 0.1uF, +/- 10%, 50 V, 0603 (1608 Metric); Capacitor Type: Ceramic; Voltage Rating: 50V; Min Operating Temperature: -55°C; Max Operating Temperature: 125°C; Mounting Technology: SMT; Tolerance: 10%; Pins: 2; Case/Package: 0603
C18 = CMP-001-00098-1: Tolerance: 10%; Capacitor Type: Ceramic; Voltage Rating: 50V; Case/Package: 0805; Mounting Technology: SMT
C22 C23 = CMP-001-00108-2: Capacitor 18pF ceramic 0603 10% 50V; Voltage Rating: 50V; Tolerance: 10%; Case/Package: 0603; Mounting Technology: SM; Capacitor Type: Ceramic
R8 = CMP-058-000032-7: RES 100K OHM 1/16W 1% 0603 SMD; Power: 62.5mW; Pins: 2; Case/Package: 0603; Mounting Technology: SMD; Tolerance: 1%
SW1 SW2 = CMP-050-000002-1: SWITCH TACT 6MM BLACK 160GF; SVP Creator: Spencer Berglund; Design Item ID: SW_TACT_SWITCH_6x6; Source: misc.SchLib; Package: 6mm x 6mm
TP3 TP4 TP8 = CMP-113-000002-1: Design Item ID: TEST POINT PC MINI .040"D WHITE; Source: Common.SchLib
TP5-TP7 = CMP-054-000001-1: Design Item ID: TEST POINT PC MINI .040"D BLACK; Source: misc.SchLib
U6 = CMP-00014-7: RISC Microcontroller, 32-Bit, 170MHz; Nominal Supply Voltage: 3.3V; RAM Size: 128; Frequency: 170Hz; Interface: JTAG; Pins: 100; RoHS Compliant: Yes; Case/Package: LQFP100; Mounting Technology: SMD
Y1 = CMP-003-00032-1: Crystal 8MHz ±10ppm (Tol) ±10ppm (Stability) 18pF FUND 80Ohm 2-Pin HC-49/USX Thru-Hole Bulk; ESR: 80; Pins: 2; Frequency: 8MHz; Case/Package: HC-49/USX; Load Capacitance: 18pF; Mounting Technology: TH

## Sheet JTAG.SchDoc
size A; SheetNumber: 5; SheetTotal: 12
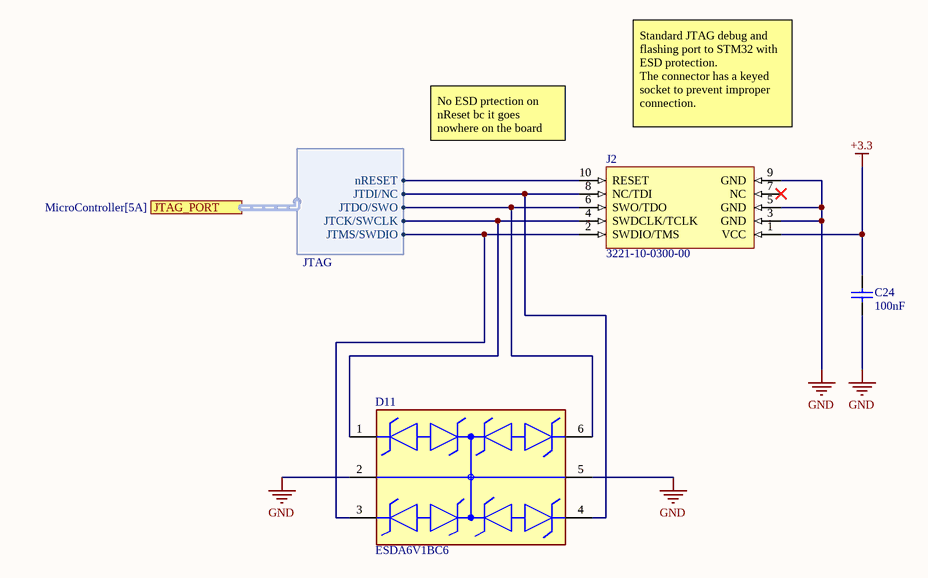
[diagram p4: JTAG.SchDoc]

### Parts
C24  value 100nF  [CAPC1608X90X40ML10T20]  (hidden comment: Capacitor 0.1uF +/-10% 50 V 0603)
D11  ESDA6V1BC6  [FP-SOT23-6L-IPC_A]
J2  3221-10-0300-00  [3221-10-0300-00-Footprint-1]

### Ports
JTAG_PORT (harness JTAG, see MicroController[5A])

### Harnesses
JTAG: JTMS/SWDIO, JTCK/SWCLK, JTDO/SWO, JTDI/NC, nRESET

### Nets
+3.3: C24.2 J2.1(VCC)
GND: C24.1 D11.2 D11.5 J2.3(GND) J2.5(GND) J2.9(GND)
JTCK: D11.1 J2.4(SWDCLK/TCLK) ; port JTAG_PORT.JTCK/SWCLK
JTDI: D11.4 J2.8(NC/TDI) ; port JTAG_PORT.JTDI/NC
JTDO: D11.6 J2.6(SWO/TDO) ; port JTAG_PORT.JTDO/SWO
JTMS: D11.3 J2.2(SWDIO/TMS) ; port JTAG_PORT.JTMS/SWDIO
NetJ2_10: J2.10(RESET) ; port JTAG_PORT.nRESET

Not connected (* = marked no-connect by the designer): J2 7(NC)*

### Notes on the sheet
- Standard JTAG debug and flashing port to STM32 with ESD protection.
  The connector has a keyed socket to prevent improper connection.
- No ESD prtection on nReset bc it goes nowhere on the board

### Library data of the parts
C24 = CMP-001-00017-10: as C12 on sheet MicroController; Min Operating Temperature: -55°C; Max Operating Temperature: 125°C; Mounting Technology: SMT; Tolerance: 10%; Pins: 2; Case/Package: 0603
D11 = CMP-004-00048-1: Trans Voltage Suppressor Diode, 80W, 5V V(RWM), Bidirectional, 4 Element, Silicon; Max Surge Current: 8A; Peak Inverse Voltage: 8V; Max Operating Temperature: 150°C; Pins: 6; Mounting Technology: SMD; RoHS Compliant: Yes; Case/Package: SOT23-6L
J2 = CMP-002-00077-1: JTAG STLINK CONN HEADER SMD 10POS 1.27MM

## Sheet CanTrans.SchDoc
size A; SheetNumber: 6; SheetTotal: 12
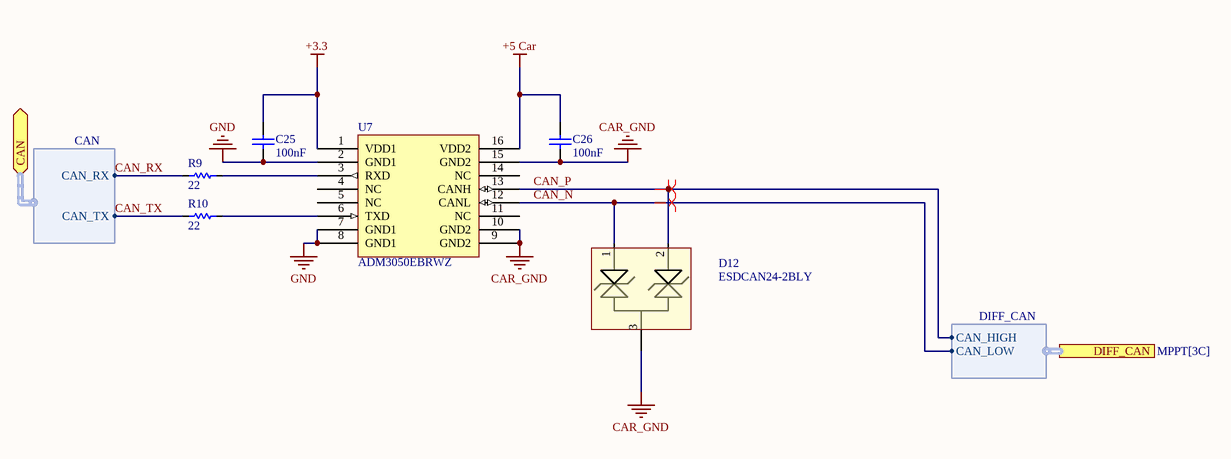
[diagram p5: CanTrans.SchDoc]

### Parts
C25  value 100nF  [CAPC1608X90X40ML10T20]  (hidden comment: Capacitor 0.1uF +/-10% 50 V 0603)
C26  value 100nF  [CAPC1608X90X40ML10T20]  (hidden comment: Capacitor 0.1uF +/-10% 50 V 0603)
D12  ESDCAN24-2BLY  [SOT23-3]
R9  value 22  [0603_RESISTOR]  (hidden comment: Res 0603 22.1 ohm 1%)
R10  value 22  [0603_RESISTOR]  (hidden comment: Res 0603 22.1 ohm 1%)
U7  ADM3050EBRWZ  [SOIC127P1030X265-16N]

### Ports
CAN (bidir, harness CAN, see MPPT[3C], MicroController[4A]), DIFF_CAN (harness DIFF_CAN, see MPPT[3C])

### Harnesses
CAN: CAN_TX, CAN_RX
DIFF_CAN: CAN_HIGH, CAN_LOW

### Nets
+3.3: C25.2 U7.1(VDD1)
+5 Car: C26.1 U7.16(VDD2)
CAR_GND: C26.2 D12.3 U7.9(GND2) U7.10(GND2) U7.15(GND2)
GND: C25.1 U7.2(GND1) U7.7(GND1) U7.8(GND1)
CAN_N: D12.1 U7.12(CANL) ; port DIFF_CAN.CAN_LOW
CAN_P: D12.2 U7.13(CANH) ; port DIFF_CAN.CAN_HIGH
CAN_RX: R9.1 ; port CAN.CAN_RX
CAN_TX: R10.1 ; port CAN.CAN_TX
NetR9_2: R9.2 U7.3(RXD)
NetR10_2: R10.2 U7.6(TXD)

Not connected (* = marked no-connect by the designer): U7 4(NC) 5(NC) 11(NC) 14(NC)

### Layout directives
differential pair: CAN_N, CAN_P

### Library data of the parts
C25 C26 = CMP-001-00017-10: Chip Capacitor, 0.1uF, +/- 10%, 50 V, 0603 (1608 Metric); Voltage Rating: 50V; Capacitor Type: Ceramic; Max Operating Temperature: 125°C; Case/Package: 0603; Mounting Technology: SMT; Pins: 2; Tolerance: 10%; Min Operating Temperature: -55°C
D12 = CMP-004-00032-2: ESD Suppressor TVS 24V Automotive 3-Pin SOT-23 T/R; Max Power Dissipation: 230W; Number of Channels: 2; Capacitance: 30pF; Leakage Current: 100nA; Polarity: Bidirectional; ESD Protection: Yes; Clamping Voltage: 43V; Diode Type: ZENER; Breakdown Voltage: 27V; Peak Pulse Current: 5.5A; Min Breakdown Voltage: 26.2V; Element Configuration: Dual; Power Line Protection: No; Height: 1.4mm; Mount: Surface Mount; Termination: SMD/SMT; Number of Pins: 3; Resistor Type: Zener; RoHS Compliant: Yes; Number of Bidirectional Channels: 2; Working Voltage: 24V; Min Operating Temperature: -40°C; REACH SVHC: No SVHC; Width: 1.75mm; Reverse Standoff Voltage: 24V; Case/Package: SOT-23; Series: Automotive, AEC-Q101, ESDCAY, TRANSIL™; Radiation Hardening: No; Package Quantity: 1; Direction: Bidirectional; Peak Pulse Power: 230W; Max Reverse Leakage Current: 100nA; Max Operating Temperature: 150°C; Length: 2.9mm; Depth: 1.3mm; Packaging: Tape and Reel; Lead Free: Lead Free
R9 R10 = CMP-058-000007-6: RES 22 OHM 1/16W 1% 0603 SMD; Power: 62.5mW; Tolerance: 1%; Case/Package: 0603; Mounting Technology: SMD; Pins: 2
U7 = CMP-015-00019-2: MIL-STD-1553 Data Bus Transceiver, PDSO16. Isolated CANFD transceiver; Nominal Supply Voltage: 5V; Max Supply Voltage: 5.5V; Min Supply Voltage: 1.7V; Case/Package: SOIC-16; Mounting Technology: SMD; RoHS Compliant: Yes; Max Operating Temperature: 125°C; Pins: 16; Min Operating Temperature: -45°C

## Sheet Voltage_Measurment.SchDoc
size A; SheetNumber: 7; SheetTotal: 12
Used 3 times, as channels Array Scaling, Battery Scaling, PreCharge Scalaing. Parts and nets are listed once, with the designators drawn on the sheet.
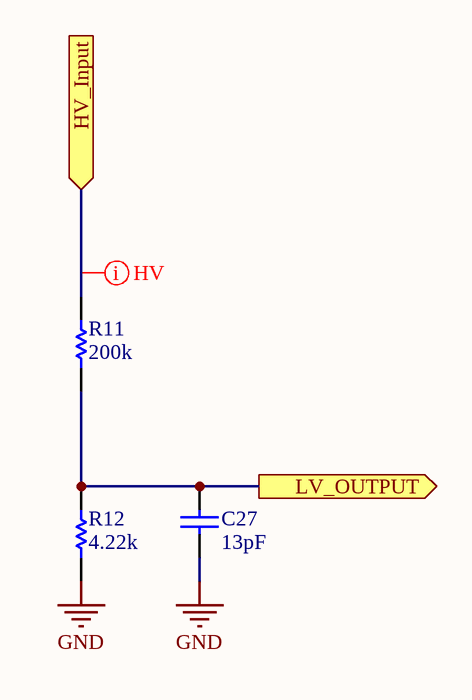
[diagram p6: Voltage_Measurment.SchDoc]

### Parts
C27  value 13pF  [0603_CAPACITOR]  (hidden comment: Capacitor 13pF 0603 5% 50V)
R11  value 200k  [1206_RESISTOR]  (hidden comment: Resistor 200K 1206 1% 1/4W)
R12  value 4.22k  [0603_RESISTOR]  (hidden comment: Resistor 4.22k 0603 0.1W 1%)

### Ports
HV_Input (in, see MPPT[2B]), LV_OUTPUT (out, see MPPT[2C])

### Nets
GND: C27.1 R12.1
HV_Input: R11.2 ; port HV_Input
LV_OUTPUT: C27.2 R11.1 R12.2 ; port LV_OUTPUT

### Channels
Array Scaling: designators end in A; ports HV_Input=Array_Measure LV_OUTPUT=NetC27A_2
Battery Scaling: designators end in B; ports HV_Input=boost_output LV_OUTPUT=NetC27B_2
PreCharge Scalaing: designators end in C; ports HV_Input=NetK1_4 LV_OUTPUT=NetC27C_2

### Layout directives
net class HV: Array_Measure

### Library data of the parts
C27 = CMP-001-00121-1: Ceramic Capacitor, Multilayer, Ceramic, 50V, 5% +Tol, 5% -Tol, C0G, 30ppm/Cel TC, 0.000013uF, Surface Mount, 0603; Tolerance: 5%; Min Operating Temperature: -55°C; Max Operating Temperature: 125°C; Mounting Technology: SMD; Case/Package: 0603; Voltage Rating: 50V; Capacitor Type: Ceramic
R11 = Resistor     0007-1: Power: 250mW; Max Operating Temperature: 155°C; Tolerance: 1%; Min Operating Temperature: -55°C; Mounting Technology: SMD; RoHS Compliant: Yes; Case/Package: 1206
R12 = Resistor     0006-1: Fixed Resistor, Metal Glaze/thick Film, 0.1W, 4220ohm, 75V, 1% +/-Tol, 100ppm/Cel, Surface Mount, 0603; Power: 100mW; Case/Package: 0603; Tolerance: 1%; RoHS Compliant: Yes; Mounting Technology: SMD; Min Operating Temperature: -55°C; Max Operating Temperature: 155°C

## Sheet LVRegulation.SchDoc
size A; SheetNumber: 8; SheetTotal: 12; SPICEModelCacheTGRHLAKJ: <root> / <DocumentId>TGRHLAKJ</DocumentId> / </root>
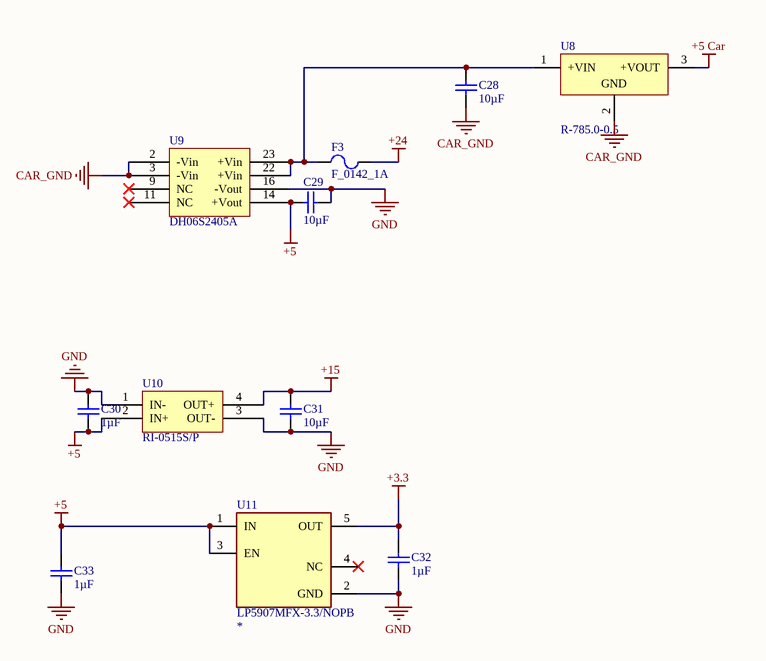
[diagram p7: LVRegulation.SchDoc]

### Parts
C28  value 10µF  [1210_Capacitor]  (hidden comment: Cap Cerem 10uF 10% 50V)
C29  value 10µF  [1210_Capacitor]  (hidden comment: Cap Cerem 10uF 10% 50V)
C30  value 1µF  [0805_Capacitor]  (hidden comment: CAP 0805 1uF 50V)
C31  value 10µF  [1210_Capacitor]  (hidden comment: Cap Cerem 10uF 10% 50V)
C32  value 1µF  [0805_Capacitor]  (hidden comment: CAP 0805 1uF 50V)
C33  value 1µF  [0805_Capacitor]  (hidden comment: CAP 0805 1uF 50V)
F3  F_0142_1A  [0154_FUSE_HOLDER]
U8  R-785.0-0.5  [REPO-R-78XX-3_V]
U9  DH06S2405A  [DH06S2405A-Footprint-1]
U10  RI-0515S/P  [ROE-2405S-Footprint-1]
U11  LP5907MFX-3.3/NOPB  [FP-DBV0005A-MFG]

### Nets
+3.3: C32.2 U11.5(OUT)
+5: C29.1 C30.1 C33.2 U9.14(+Vout) U10.2(IN+) U11.1(IN) U11.3(EN)
+5 Car: U8.3(+VOUT)
+15: C31.2 U10.4(OUT+)
+24: F3.2
CAR_GND: C28.1 U8.2(GND) U9.2(-Vin) U9.3(-Vin)
GND: C29.2 C30.2 C31.1 C32.1 C33.1 U9.16(-Vout) U10.1(IN-) U10.3(OUT-) U11.2(GND)
NetC28_2: C28.2 F3.1 U8.1(+VIN) U9.22(+Vin) U9.23(+Vin)

Not connected (* = marked no-connect by the designer): U9 9(NC)* 11(NC)*; U11 4(NC)*

### Library data of the parts
C28 C29 C31 = CMP-001-00101-3: Capacitor Type: Ceramic; Mounting Technology: SM; Tolerance: 10%; Voltage Rating: 50V; Case/Package: 1210
C30 C32 C33 = CMP-001-00098-1: Tolerance: 10%; Capacitor Type: Ceramic; Voltage Rating: 50V; Case/Package: 0805; Mounting Technology: SMT
F3 = CMP-105-000000-1: SVP Creator: Spencer Berglund; Current: 1A; Design Item ID: F_0142_1A; Source: Common.SchLib
U8 = CMP-019-00059-1: DC-DC Regulated Power Supply Module, 1 Output, 2.5W, Hybrid; Output Current: 500mA; Min Supply Voltage: 6.5V; Output Voltage: 5V; Max Supply Voltage: 32V; RoHS Compliant: Yes; Pins: 3; Mounting Technology: TH; Max Operating Temperature: 71°C; Min Operating Temperature: -40°C; Case/Package: SIP-3
U9 = CMP-019-00061-4: DC/DC converter 18...75 VDC 5 VDC, DJ06S4805A, Delta-Electronics; Output Voltage: 5V; Max Supply Voltage: 36V; Min Supply Voltage: 18V; Output Current: 1.2A; RoHS Compliant: Yes; Min Operating Temperature: -40°C; Max Operating Temperature: 85°C; Mounting Technology: TH; Case/Package: DIP; Pins: 8
U10 = CMP-019-00064-1: DC-DC Unregulated Power Supply Module, 1 Output, 2W, Hybrid; Min Supply Voltage: 4.5V; Max Supply Voltage: 5V; Output Voltage: 15V; Output Current: 133mA; Max Operating Temperature: 85°C; Pins: 4; RoHS Compliant: Yes; Min Operating Temperature: -40°C; Mounting Technology: TH; Case/Package: 4-SIP
U11 = CMP-171-000000-7: Fixed Positive LDO Regulator, 3.3V, 0.25V Dropout, PDSO5; Output Voltage1-Max: 3.366V; Number of Functions: 1; Input Voltage Absolute-Max: 6V; Dropout Voltage1-Nom: 120mV; MP: LP5907MFX-3.0/NOPB; Min Input Voltage: 2.2V; MF: Texas Instruments; Regulator Type: FIXED POSITIVE SINGLE OUTPUT LDO REGULATOR; Output Voltage1-Min: 3.234V; Package Equivalence Code: TSOP5/6,.11,37; Package Body Material: Plastic; Dropout Voltage1-Max: 250mV; Qualification Status: Not Qualified; Max Input Voltage: 5.5V; Voltage Tolerance-Max: 2%; Output Current1-Max: 250mA; Packaging: Tape and Reel; Reach SVHC Compliant: Yes; RoHS Compliant: Yes; Moisture Sensitivity Level: 1; Technology: CMOS; Component Type: Standard; SnapEDA_Link: https://www.snapeda.com/parts/LP5907MFX-3.0/NOPB/Texas%20Instruments/view-part/379728/?ref=snap; Source: LP5907MFX-3.0_NOPB.SchLib; Mouser-Purchase-URL: https://snapeda.com/shop?store=Mouser&id=379728; Value: *; Terminal Form: Gull Wing; Number of Outputs: 1; Number of Pins: 5; JESD-30 Code: R-PDSO-G5; Height - Seated (Max): 1.45mm; Availability: Unavailable; JESD-609 Code: e3; Arrow_Electronics-Purchase-URL: https://snapeda.com/shop?store=Arrow+Electronics&id=379728; Width: 1.6mm; Package Shape: Rectangular; Texas_Instruments-Purchase-URL: https://snapeda.com/shop?store=Texas+Instruments&id=379728; Peak Reflow Temperature (Cel): 260°C; Package Code: LSSOP; Pin Count: 5; Price: None; Package Style: SMALL OUTLINE, LOW PROFILE, SHRINK PITCHMeter; Terminal Finish: Tin; Output Voltage1-Nom: 3.3V; Adjustability: FIXED; Terminal Pitch: 0.95mm; Terminal Position: DUAL; DigiKey-Purchase-URL: https://snapeda.com/shop?store=DigiKey&id=379728; Operating Temperature, TJ-Min: -40°C; Surface Mount: Yes; Package: SOT-23-5 Texas Instruments; Length: 2.9mm; Operating Temperature, TJ-Max: 125°C; Design Item ID: LP5907MFX-3.0/NOPB

## Sheet hv_Isolation.SchDoc
size A; SheetNumber: 9; SheetTotal: 12
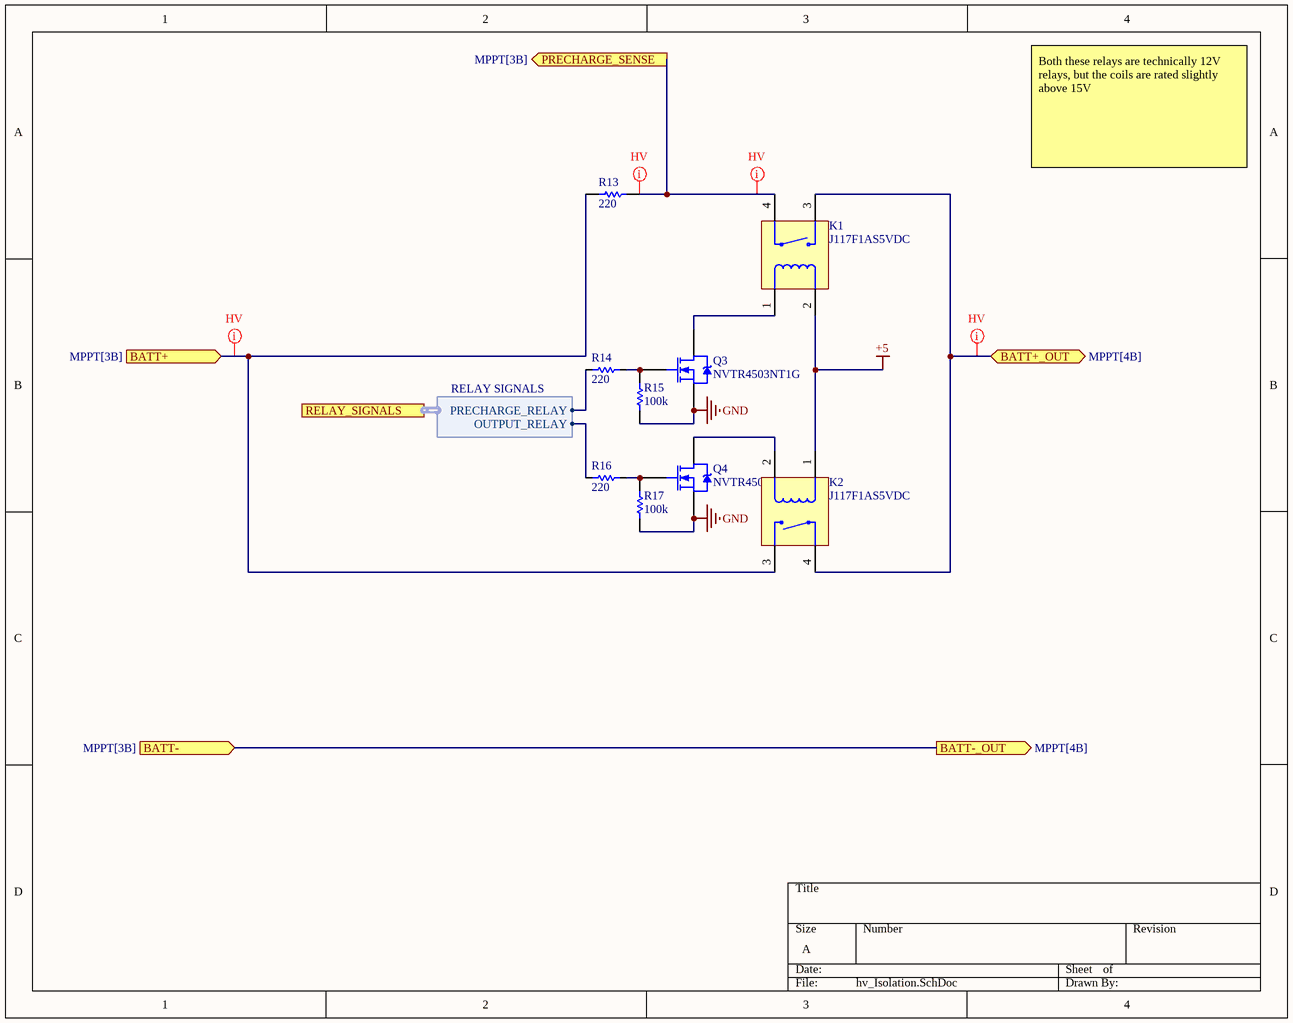
[diagram p8: hv_Isolation.SchDoc]

### Parts
K1  J117F1AS5VDC  [J117F1AS5VDC-Footprint]
K2  J117F1AS5VDC  [J117F1AS5VDC-Footprint]
Q3  NVTR4503NT1G  [SOT-23_N]
Q4  NVTR4503NT1G  [SOT-23_N]
R13  value 220  [R_Res_Axial_SQP_THRU]  (hidden comment: SQPW10220RJ)
R14  value 220  [0603_RESISTOR]  (hidden comment: R 0603 220 ohm 1%)
R15  value 100k  [RESC1608X55X25ML10T15]  (hidden comment: Resistor 100k +/-1% 0603 100 mW)
R16  value 220  [0603_RESISTOR]  (hidden comment: R 0603 220 ohm 1%)
R17  value 100k  [RESC1608X55X25ML10T15]  (hidden comment: Resistor 100k +/-1% 0603 100 mW)

### Ports
BATT+ (in, see MPPT[3B]), BATT+_OUT (bidir, see MPPT[4B]), BATT- (in, see MPPT[3B]), BATT-_OUT (out, see MPPT[4B]), PRECHARGE_SENSE (out, see MPPT[3B]), RELAY_SIGNALS (harness RELAY SIGNALS, see MPPT[3B], MicroController[2B])

### Harnesses
RELAY SIGNALS: OUTPUT_RELAY, PRECHARGE_RELAY

### Nets
+5: K1.2(CTRL-) K2.1(CTRL+)
GND: Q3.2(S) Q4.2(S) R15.1 R17.1 ; port BATT-_OUT, port BATT-
Bat+: K1.3(DC-) K2.4(DC+) ; port BATT+_OUT
NetF1_2: K2.3(DC-) R13.1 ; port BATT+
NetK1_1: K1.1(CTRL+) Q3.3(D)
NetK1_4: K1.4(DC+) R13.2 ; port PRECHARGE_SENSE
NetK2_2: K2.2(CTRL-) Q4.3(D)
NetQ3_1: Q3.1(G) R14.2 R15.2
NetQ4_1: Q4.1(G) R16.2 R17.2
NetR14_1: R14.1 ; port RELAY_SIGNALS.PRECHARGE_RELAY
NetR16_1: R16.1 ; port RELAY_SIGNALS.OUTPUT_RELAY

### Layout directives
net class HV: Bat+, NetF1_2, NetK1_4

### Notes on the sheet
- Both these relays are technically 12V relays, but the coils are rated slightly above 15V

### Library data of the parts
K1 K2 = CMP-008-00017-3: Relay Gen Purpose SPST 10A 5V; Operate Time: 10ms; Coil Voltage: 5; RoHS Compliant: yes; Pins: 4; Contact Form: SPST; Mounting Technology: TH; Max Operating Temperature: 125°C; Current Rating: 10A; Min Operating Temperature: -55°C
Q3 Q4 = CMP-062-000014-2: Small Signal Field-Effect Transistor, 1.5A I(D), 30V, 1-Element, N-Channel, Silicon, Metal-oxide Semiconductor FET, TO-236; Max Operating Temperature: 150°C; Case/Package: SOT23; PackageReference: SOT-23; Vgs(th) (Max) @ Id: 1.5A; RoHS Compliant: Yes; Pins: 3
R13 = Resistor     0016-2: Fixed Resistor, Wire Wound, 10W, 220ohm, 750V, 5% +/-Tol, 300ppm/Cel, Through Hole Mount; Tolerance: 5%; Case/Package: Axial; Pins: 2; RoHS Compliant: Yes; Mounting Technology: TH; Min Operating Temperature: -55°C; Power: 10W; Max Operating Temperature: 155°C
R14 R16 = CMP-058-000021-5: RES 220 OHM 1/16W 1% 0603 SMD; Power: 62.5mW; Case/Package: 0603; Tolerance: 1%; Mounting Technology: SMD; Pins: 2
R15 R17 = CMP-009-00023-8: Chip Resistor, 100 KOhm, +/- 1%, 0.1 W, -55 to 155 degC, 0603 (1608 Metric); Power: 100mW; Voltage Rating: 50V; Case/Package: 0603; RoHS Compliant: True; Mounting Technology: SMD; Min Operating Temperature: -55°C; Tolerance: 1%; Pins: 2; Max Operating Temperature: 155°C

## Sheet indicator_leds.SchDoc
size A; SheetNumber: 10; SheetTotal: 12
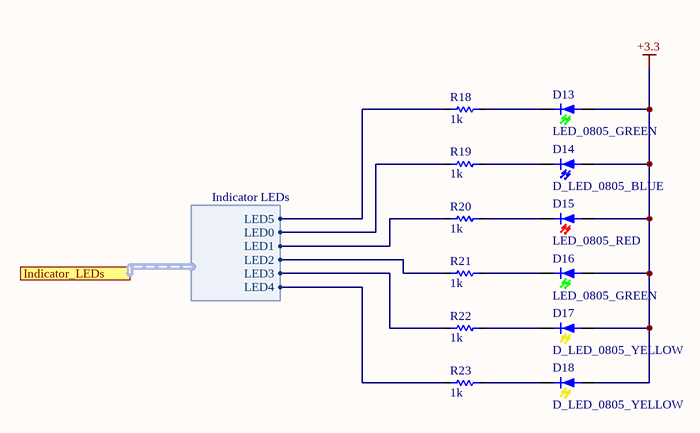
[diagram p9: indicator_leds.SchDoc]

### Parts
D13  LED_0805_GREEN  [0805_LED_Green]
D14  D_LED_0805_BLUE  [0805_LED_Blue]
D15  LED_0805_RED  [0805_LED_Red]
D16  LED_0805_GREEN  [0805_LED_Green]
D17  D_LED_0805_YELLOW  [0805_LED_Yellow]
D18  D_LED_0805_YELLOW  [0805_LED_Yellow]
R18  value 1k  [0603_RESISTOR]  (hidden comment: Res 0603 1K ohm 1%)
R19  value 1k  [0603_RESISTOR]  (hidden comment: Res 0603 1K ohm 1%)
R20  value 1k  [0603_RESISTOR]  (hidden comment: Res 0603 1K ohm 1%)
R21  value 1k  [0603_RESISTOR]  (hidden comment: Res 0603 1K ohm 1%)
R22  value 1k  [0603_RESISTOR]  (hidden comment: Res 0603 1K ohm 1%)
R23  value 1k  [0603_RESISTOR]  (hidden comment: Res 0603 1K ohm 1%)

### Ports
Indicator_LEDs (harness Indicator LEDs, see MPPT[3C], MicroController[5B])

### Harnesses
Indicator LEDs: LED0, LED1, LED2, LED3, LED4, LED5

### Nets
+3.3: D13.1(Anode) D14.1(Anode) D15.1(Anode) D16.1(Anode) D17.1(Anode) D18.1(Anode)
IND0: R19.1 ; port Indicator_LEDs.LED0
IND1: R20.1 ; port Indicator_LEDs.LED1
IND2: R21.1 ; port Indicator_LEDs.LED2
IND3: R22.1 ; port Indicator_LEDs.LED3
IND4: R23.1 ; port Indicator_LEDs.LED4
IND5: R18.1 ; port Indicator_LEDs.LED5
NetD13_2: D13.2(Cathode) R18.2
NetD14_2: D14.2(Cathode) R19.2
NetD15_2: D15.2(Cathode) R20.2
NetD16_2: D16.2(Cathode) R21.2
NetD17_2: D17.2(Cathode) R22.2
NetD18_2: D18.2(Cathode) R23.2

### Library data of the parts
D13 D16 = CMP-151-000025-2: LED CHIPLED 570NM GREEN 0805 SMD; Manufacturer PN: LG R971-KN-1-0-20-R18; Manufacturer: Osram Opto Semiconductors Inc; Current: 20mA; Forward Voltage: 2.2V; SVP Creator: Nate Bolyard; Source: diode.SchLib; Package: 0805; Value: GREEN; Supplier PN: 475-1410-1-ND; Design Item ID: D_LED_0805_GREEN
D14 = CMP-151-000020-1: LED 2X1.2MM 470NM BL WTR CLR SMD; Manufacturer PN: APT2012QBC/D; Manufacturer: Kingbright; Forward Voltage: 3.3; SVP Creator: Jonathan Nutzmann; Value: BLUE; Current: 20mA; Design Item ID: D_LED_0805_BLUE; Source: diode.SchLib; Supplier PN: 754-1437-1-ND; Package: 0805
D15 = CMP-151-000016-5: LED CHIPLED 645NM RED DIFF 0805; Manufacturer: OSRAM Opto Semiconductors Inc; Manufacturer PN: LH R974-LP-1; SVP Creator: Jonathan Nutzmann; Forward Voltage: 1.8V; Current: 20mA; Package: 0805; Value: RED; Source: diode.SchLib; Design Item ID: D_LED_0805_RED
D17 D18 = CMP-151-000028-1: LED 595NM AMBER DIFF SMD 0805; Manufacturer PN: HSMA-C170; Manufacturer: Avago Technologies US Inc.; Forward Voltage: 1.9; Current: 20mA; SVP Creator: Jonathan Nutzmann; Source: diode.SchLib; Package: 0805; Supplier PN: 516-1431-1-ND; Value: Amber; Design Item ID: D_LED_0805_YELLOW
R18-R23 = CMP-058-000005-5: RES 1K OHM 1/16W 1% 0603 SMD; Power: 62.5mW; Case/Package: 0603; Mounting Technology: SMD; Pins: 2; Tolerance: 1%

## Sheet temp_measure.SchDoc
size A; SheetNumber: 11; SheetTotal: 12
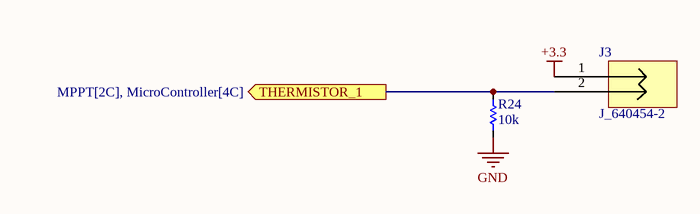
[diagram p10: temp_measure.SchDoc]

### Parts
J3  J_640454-2  [640454-2]
R24  value 10k  [0603_RESISTOR]  (hidden comment: Res 0603 10K ohm 1%)

### Ports
THERMISTOR_1 (out, see MPPT[2C], MicroController[4C])

### Nets
+3.3: J3.1
GND: R24.1
NetJ3_2: J3.2 R24.2 ; port THERMISTOR_1

### Library data of the parts
J3 = CMP-009-000000-4: 2 Positions Header, Unshrouded Connector 0.100" (2.54mm) Through Hole Tin; Max Current Rating: 2A; Gender: Male; Pins: 2; Mounting Technology: TH
R24 = CMP-058-000017-6: RES 10K OHM 1/16W 1% 0603 SMD; Power: 62.5mW; Pins: 2; Case/Package: 0603; Tolerance: 1%; Mounting Technology: SMD

## Sheet UART.SchDoc
size A; SheetNumber: 12; SheetTotal: 12
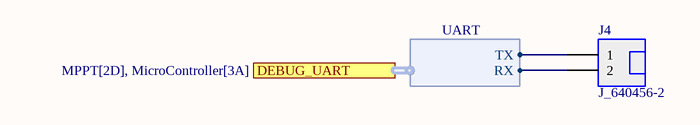
[diagram p11: UART.SchDoc]

### Parts
J4  J_640456-2  [J_640456-2]

### Ports
DEBUG_UART (harness UART, see MPPT[2D], MicroController[3A])

### Harnesses
UART: TX, RX

### Nets
NetJ4_1: J4.1 ; port DEBUG_UART.TX
NetJ4_2: J4.2 ; port DEBUG_UART.RX

### Library data of the parts
J4 = CMP-002-00087-1: Connector Header Through Hole 2 position 0.100" (2.54mm); Manufacturer: TE Connectivity; Voltage Rating: 250V; Contact Resistance: 6mR; Current Rating: 5A; Manufacturer Part Number: 640456-2; Design Item ID: J_640456-2; Source: connector.SchLib; Max Operating Temperature: 221°C; Min Operating Temperature: -67°C

## Nets that join several sheets
+3.3: GateDriver (U1.1 U2.1), Power (C3.2 C4.2 U4.8 U5.8), MicroController (18 pins), JTAG (C24.2 J2.1), CanTrans (C25.2 U7.1), LVRegulation (C32.2 U11.5), indicator_leds (6 pins), temp_measure (J3.1)
+5: LVRegulation (7 pins), hv_Isolation (K1.2 K2.1)
+5 Car: CanTrans (C26.1 U7.16), LVRegulation (U8.3)
+15: GateDriver (C2.2 D1.2 U2.8), LVRegulation (C31.2 U10.4)
+24: MPPT (J1.7 J1.12), LVRegulation (F3.2)
CAR_GND: MPPT (J1.8 J1.11), CanTrans (5 pins), LVRegulation (C28.1 U8.2 U9.2 U9.3)
GND: MPPT (U3.2 U3.4), GateDriver (6 pins), Power (16 pins), MicroController (24 pins), JTAG (6 pins), CanTrans (C25.1 U7.2 U7.7 U7.8), Array Scaling (C27A.1 R12A.1), Battery Scaling (C27B.1 R12B.1), LVRegulation (9 pins), hv_Isolation (Q3.2 Q4.2 R15.1 R17.1), temp_measure (R24.1), PreCharge Scalaing (C27C.1 R12C.1)
Array+: MPPT (U3.3), Power (F2.1)
Array_Measure: Power (F2.2 M3.1 U5.1 U5.2), Array Scaling (R11A.2)
Bat+: MPPT (U3.1), hv_Isolation (K1.3 K2.4)
boost_output: Power (9 pins), Battery Scaling (R11B.2)
CAN_N: MPPT (J1.2 J1.6), CanTrans (D12.1 U7.12)
CAN_P: MPPT (J1.1 J1.5), CanTrans (D12.2 U7.13)
CAN_RX: MicroController (U6.82), CanTrans (R9.1)
CAN_TX: MicroController (U6.83), CanTrans (R10.1)
GATE_HIGH: GateDriver (U1.2), MicroController (TP3.0 U6.79)
GATE_LOW: GateDriver (U2.2), MicroController (TP4.0 U6.93)
HIGH_SIDE_GATE: GateDriver (5 pins), Power (Q1.4)
IND0: MicroController (U6.70), indicator_leds (R19.1)
IND1: MicroController (U6.69), indicator_leds (R20.1)
IND2: MicroController (U6.68), indicator_leds (R21.1)
IND3: MicroController (U6.67), indicator_leds (R22.1)
IND4: MicroController (U6.66), indicator_leds (R23.1)
IND5: MicroController (U6.65), indicator_leds (R18.1)
JTCK: MicroController (U6.77), JTAG (D11.1 J2.4)
JTDI: MicroController (U6.78), JTAG (D11.4 J2.8)
JTDO: MicroController (U6.90), JTAG (D11.6 J2.6)
JTMS: MicroController (U6.76), JTAG (D11.3 J2.2)
KELVIN_SENSE_HIGH: GateDriver (C1.1 D2.1 D6.1 U1.5), Power (Q1.3)
KELVIN_SENSE_LOW: GateDriver (C2.1 D5.1 D7.1 U2.5), Power (Q2.3)
LOW_SIDE_GATE: GateDriver (5 pins), Power (Q2.4)
NetC27A_2: MicroController (U6.32), Array Scaling (C27A.2 R11A.1 R12A.2)
NetC27B_2: MicroController (U6.25), Battery Scaling (C27B.2 R11B.1 R12B.2)
NetC27C_2: MicroController (U6.50), PreCharge Scalaing (C27C.2 R11C.1 R12C.2)
NetF1_2: Power (F1.2), hv_Isolation (K2.3 R13.1)
NetJ3_2: MicroController (U6.41), temp_measure (J3.2 R24.2)
NetJ4_1: MicroController (U6.97), UART (J4.1)
NetJ4_2: MicroController (U6.98), UART (J4.2)
NetK1_4: hv_Isolation (K1.4 R13.2), PreCharge Scalaing (R11C.2)
NetR14_1: MicroController (U6.16), hv_Isolation (R14.1)
NetR16_1: MicroController (U6.17), hv_Isolation (R16.1)
NetTP1_0: Power (TP1.0 U4.7), MicroController (U6.20)
NetTP2_0: Power (TP2.0 U5.7), MicroController (U6.53)